# Altium schematic sheet ConnectorBoard_r2.SchDoc
size A4
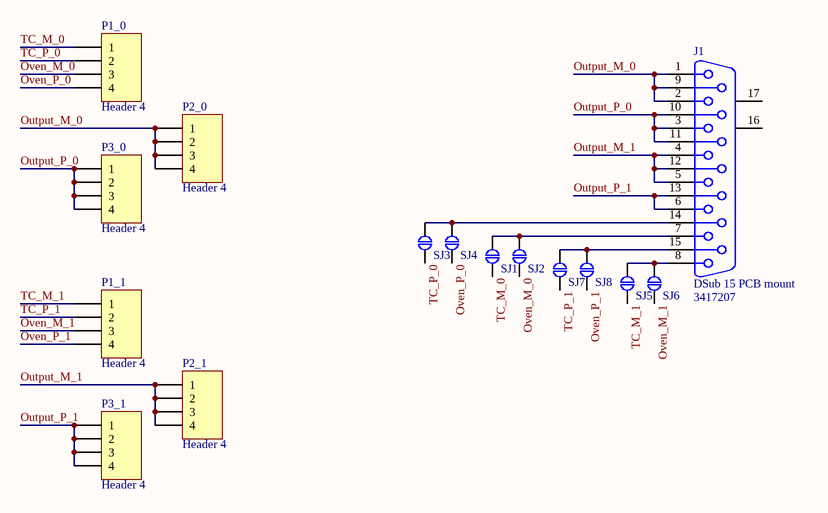
[diagram p0: ConnectorBoard_r2.SchDoc]

## Parts
J1  DSub 15 PCB mount  Supplier Part Number 1: 3417207  [DSub15-female]
P1_0  Header 4  [HDR1X4]
P1_1  Header 4  [HDR1X4]
P2_0  Header 4  [HDR1X4]
P2_1  Header 4  [HDR1X4]
P3_0  Header 4  [HDR1X4]
P3_1  Header 4  [HDR1X4]
SJ1  Solder_jumper  [SOLDER_JUMPER]  (value not drawn)
SJ2  Solder_jumper  [SOLDER_JUMPER]  (value not drawn)
SJ3  Solder_jumper  [SOLDER_JUMPER]  (value not drawn)
SJ4  Solder_jumper  [SOLDER_JUMPER]  (value not drawn)
SJ5  Solder_jumper  [SOLDER_JUMPER]  (value not drawn)
SJ6  Solder_jumper  [SOLDER_JUMPER]  (value not drawn)
SJ7  Solder_jumper  [SOLDER_JUMPER]  (value not drawn)
SJ8  Solder_jumper  [SOLDER_JUMPER]  (value not drawn)

## Nets
Output_M_0: J1.1 J1.2 J1.9 P2_0.1 P2_0.2 P2_0.3 P2_0.4
Output_M_1: J1.4 J1.5 J1.12 P2_1.1 P2_1.2 P2_1.3 P2_1.4
Output_P_0: J1.3 J1.10 J1.11 P3_0.1 P3_0.2 P3_0.3 P3_0.4
Output_P_1: J1.6 J1.13 P3_1.1 P3_1.2 P3_1.3 P3_1.4
Oven_M_0: P1_0.3 SJ2.1
Oven_M_1: P1_1.3 SJ6.1
Oven_P_0: P1_0.4 SJ4.1
Oven_P_1: P1_1.4 SJ8.1
TC_M_0: P1_0.1 SJ1.1
TC_M_1: P1_1.1 SJ5.1
TC_P_0: P1_0.2 SJ3.1
TC_P_1: P1_1.2 SJ7.1
NetJ1_7: J1.7 SJ1.2 SJ2.2
NetJ1_8: J1.8 SJ5.2 SJ6.2
NetJ1_14: J1.14 SJ3.2 SJ4.2
NetJ1_15: J1.15 SJ7.2 SJ8.2

Not connected (* = marked no-connect by the designer): J1 16(MH1) 17(MH2)

## Library data of the parts
P1_0 P1_1 P2_0 P2_1 P3_0 P3_1 = Header 4: Header, 4-Pin; LatestRevisionDate: 17-Jul-2002; LatestRevisionNote: Re-released for DXP Platform.; Publisher: Altium Limited
SJ1-SJ8 = Solder_jumper: PCB solder jumper
J1 = DSub 15 PCB mount: Supplier 1: Farnell